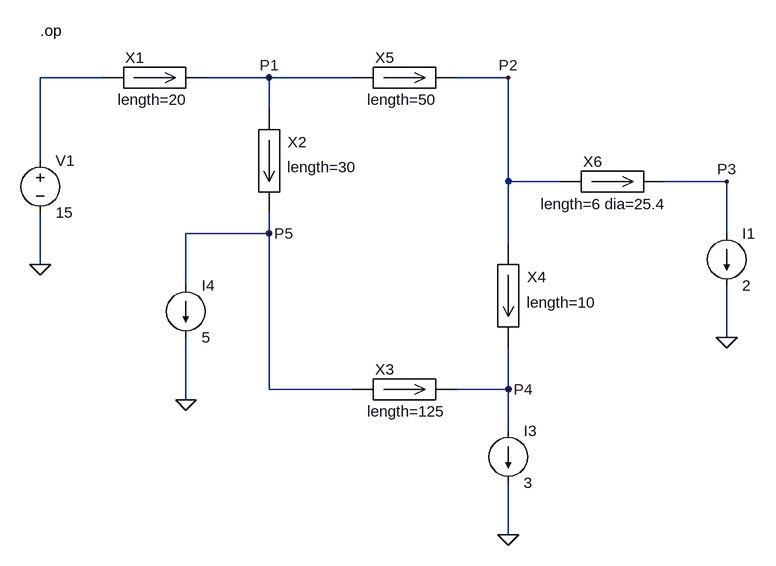
[diagram p0: schematic Example_Static.asc]
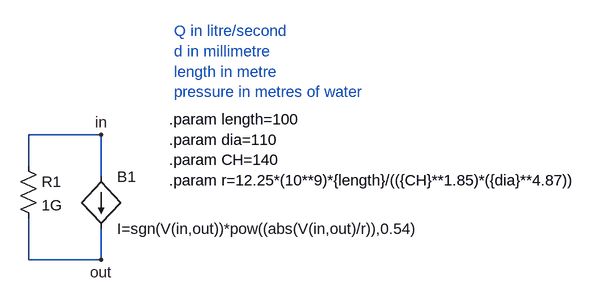
[diagram p1: sub-circuit pipe.asc]
Example_Static.asc, the LTspice schematic file:
Version 4
SHEET 1 1604 936
WIRE 48 192 -48 192
WIRE 304 192 208 192
WIRE 432 192 304 192
WIRE 672 192 592 192
WIRE 304 240 304 192
WIRE -48 320 -48 192
WIRE 672 352 672 192
WIRE 752 352 672 352
WIRE 1008 352 912 352
WIRE 304 432 304 400
WIRE 304 432 176 432
WIRE 1008 432 1008 352
WIRE 672 448 672 352
WIRE -48 480 -48 400
WIRE 176 512 176 432
WIRE 1008 592 1008 512
WIRE 304 672 304 432
WIRE 432 672 304 672
WIRE 672 672 672 608
WIRE 672 672 592 672
WIRE 176 688 176 592
WIRE 672 736 672 672
WIRE 672 896 672 816
FLAG -48 480 0
FLAG 1008 592 0
FLAG 672 896 0
FLAG 176 688 0
FLAG 304 192 P1
FLAG 672 192 P2
FLAG 1008 352 P3
FLAG 672 672 P4
FLAG 304 432 P5
SYMBOL voltage -48 304 R0
WINDOW 123 0 0 Left 0
WINDOW 39 0 0 Left 0
SYMATTR InstName V1
SYMATTR Value 15
SYMBOL Pipe 128 192 R0
WINDOW 0 -45 -31 Left 2
WINDOW 39 -57 34 Left 2
SYMATTR InstName X1
SYMATTR SpiceLine length=20
SYMBOL Pipe 512 192 R0
WINDOW 0 -45 -31 Left 2
WINDOW 39 -57 34 Left 2
SYMATTR InstName X5
SYMATTR SpiceLine length=50
SYMBOL Pipe 832 352 R0
WINDOW 0 -45 -31 Left 2
WINDOW 39 -110 35 Left 2
SYMATTR InstName X6
SYMATTR SpiceLine length=6 dia=25.4
SYMBOL Pipe 672 528 R90
WINDOW 0 -29 -29 VLeft 2
WINDOW 39 10 -28 VLeft 2
SYMATTR InstName X4
SYMATTR SpiceLine length=10
SYMBOL Pipe 512 672 R0
WINDOW 0 -45 -31 Left 2
WINDOW 39 -57 34 Left 2
SYMATTR InstName X3
SYMATTR SpiceLine length=125
SYMBOL Pipe 304 320 R90
WINDOW 0 -29 -29 VLeft 2
WINDOW 39 10 -28 VLeft 2
SYMATTR InstName X2
SYMATTR SpiceLine length=30
SYMBOL current 1008 432 R0
WINDOW 123 0 0 Left 0
WINDOW 39 0 0 Left 0
SYMATTR InstName I1
SYMATTR Value 2
SYMBOL current 672 736 R0
WINDOW 123 0 0 Left 0
WINDOW 39 0 0 Left 0
SYMATTR InstName I3
SYMATTR Value 3
SYMBOL current 176 512 R0
WINDOW 123 0 0 Left 0
WINDOW 39 0 0 Left 0
SYMATTR InstName I4
SYMATTR Value 5
TEXT -48 120 Left 2 !.op

pipe.asc, the sub-circuit schematic file:
Version 4
SHEET 1 1436 680
WIRE 192 80 80 80
WIRE 80 128 80 80
WIRE 192 144 192 80
WIRE 80 272 80 208
WIRE 192 272 192 224
WIRE 192 272 80 272
FLAG 192 80 in
FLAG 192 272 out
SYMBOL res 64 112 R0
SYMATTR InstName R1
SYMATTR Value 1G
SYMBOL bi 192 144 R0
SYMATTR InstName B1
SYMATTR Value I=sgn(V(in,out))*pow((abs(V(in,out)/r)),0.54)
TEXT 304 -80 Left 2 ;Q in litre/second\nd in millimetre\nlength in metre\npressure in metres of water
TEXT 296 56 Left 2 !.param length=100\n.param dia=110\n.param CH=140\n.param r=12.25*(10**9)*{length}/(({CH}**1.85)*({dia}**4.87))

The netlist it stands for:
* Example_Static.asc
V1 N001 0 15
XX1 N001 P1 pipe params: length=20
XX5 P1 P2 pipe params: length=50
XX6 P2 P3 pipe params: length=6 dia=25.4
XX4 P2 P4 pipe params: length=10
XX3 P5 P4 pipe params: length=125
XX2 P1 P5 pipe params: length=30
I1 P3 0 2
I3 P4 0 3
I4 P5 0 5

* block symbol definitions
.subckt pipe in out
R1 in out 1G
B1 in out I=sgn(V(in,out))*pow((abs(V(in,out)/r)),0.54)
* Q in litre/second
* d in millimetre
* length in metre
* pressure in metres of water
.param length=100
.param dia=110
.param CH=140
.param r=12.25*(10**9)*{length}/(({CH}**1.85)*({dia}**4.87))
.ends pipe

.op
.backanno
.end